# Altium schematic sheet Power.SchDoc
size 420 x 297 mm; SheetNumber: 1; SheetTotal: 2
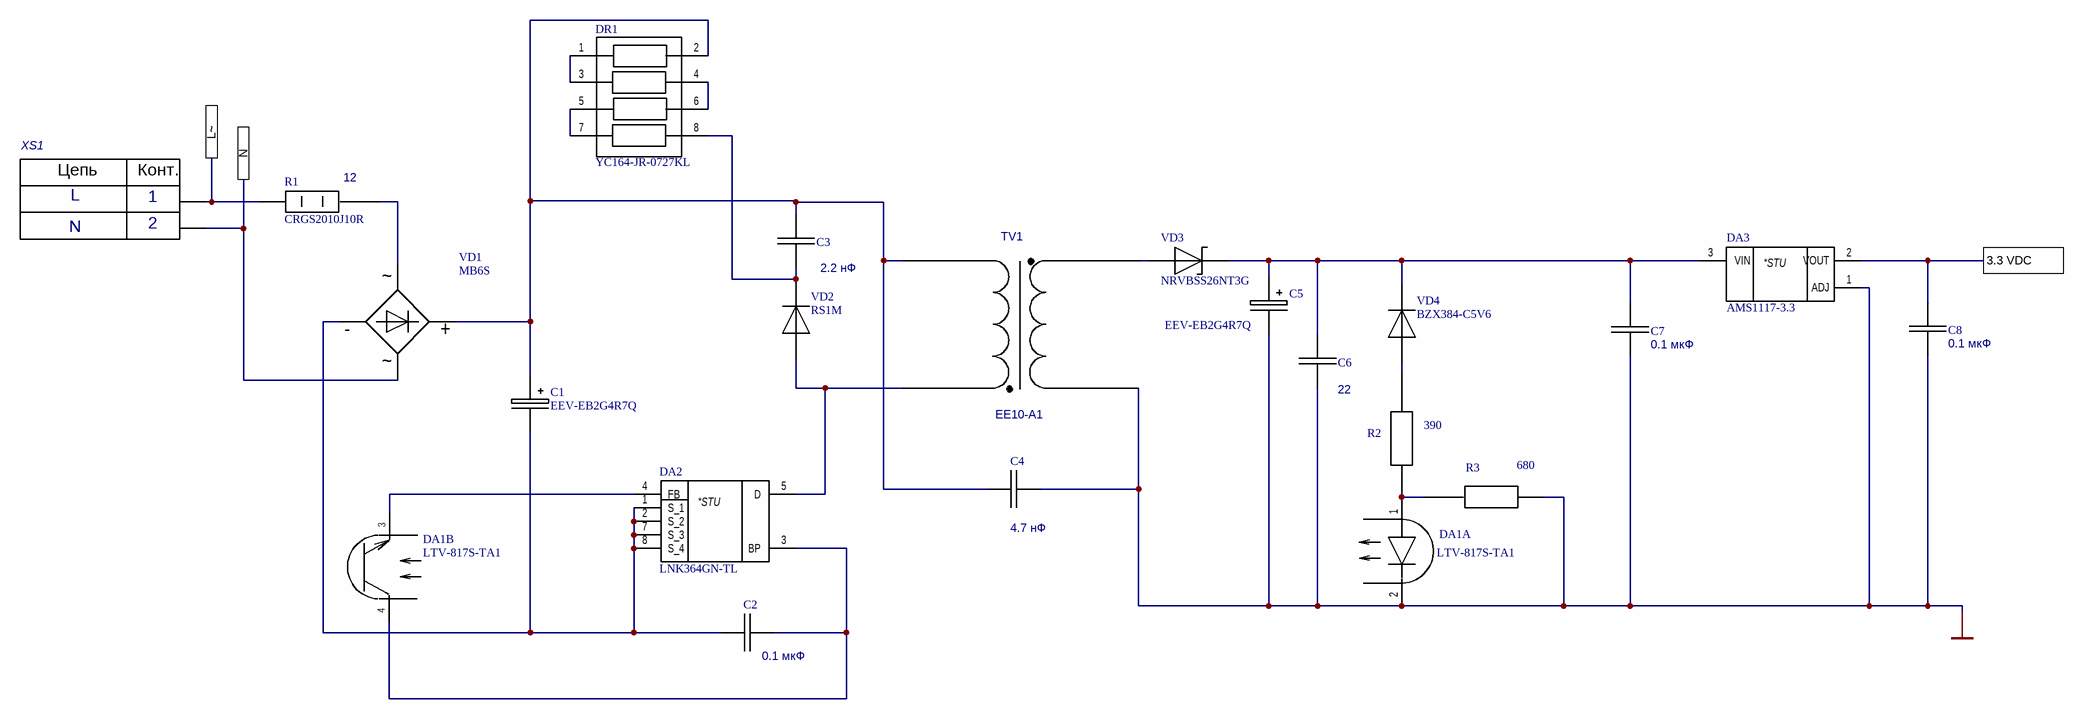
[diagram p0: Power.SchDoc]

## Parts
C1  EEV-EB2G4R7Q  [CAPAE1030X1700N]
C2  value 0.1 мкФ  [С0603]  (hidden comment: 06035C104JAT2A)
C3  value 2.2 нФ  [C1206]  (hidden comment: CC1206KKX7RBBB222)
C4  value 4.7 нФ  [B81123C1472M000]  (hidden comment: Конденсатор неполярный)
C5  EEV-EB2G4R7Q  [CAPAE1030X1700N]
C6  value 22  [C1206]  (hidden comment: CC1206KKX5R7BB226)
C7  value 0.1 мкФ  [С0603]  (hidden comment: 06035C104JAT2A)
C8  value 0.1 мкФ  [С0603]  (hidden comment: 06035C104JAT2A)
DA1  LTV-817S-TA1  [SOP254P1016X400-4N]  (parts A,B of 2)
DA2  LNK364GN-TL  [LNK364GNTL]
DA3  AMS1117-3.3  [SOT229P700X180-4N]
DR1  YC164-JR-0727KL  [CAT161000F4]
R1  CRGS2010J10R  value 12  [RESC5025X65N]
R2  value 390  [R0402]  (hidden comment: RC0402FR-07390RL)
R3  value 680  [R0402]  (hidden comment: RC0402FR-07680RL)
TV1  EE10-A1  [EE10-A1]
VD1  MB6S  [SOP250P700X190-4N]
VD2  RS1M  [DIOM5026X262N]
VD3  NRVBSS26NT3G  [DIOM5436X247N]
VD4  BZX384-C5V6  [SOD2512X110N]
XS1  S2B-PH-K-S  [ED350V-02P]  (value not drawn)

## Ports
3.3 VDC, L~, N

## Nets
DGND: C4.2 C5.2(-) C6.2 C7.1 C8.2 DA1.2(CATHODE) DA3.1(ADJ) R3.1 TV1.5
3.3 VDC: C8.1 DA3.2(VOUT) ; port 3.3 VDC
L~: R1.1 XS1.1 ; port L~
N: VD1.4 XS1.2 ; port N
NetC1_1: C1.1(+) C3.1 C4.1 DR1.2 TV1.1(Vin) VD1.1(+)
NetC1_2: C1.2(-) C2.1 DA2.1(S_1) DA2.2(S_2) DA2.7(S_3) DA2.8(S_4) VD1.2(-)
NetC2_2: C2.2 DA1.4(C) DA2.3(BP)
NetC3_2: C3.2 DR1.8 VD2.1(K)
NetC5_1: C5.1(+) C6.1 C7.2 DA3.3(VIN) VD3.1(K) VD4.1(K)
NetDA1_1: DA1.1(ANODE) R2.1 R3.2
NetDA1_3: DA1.3(E) DA2.4(FB)
NetDA2_5: DA2.5(D) TV1.4 VD2.2(A)
NetDR1_1: DR1.1 DR1.3
NetDR1_4: DR1.4 DR1.6
NetDR1_5: DR1.5 DR1.7
NetR1_2: R1.2 VD1.3
NetR2_2: R2.2 VD4.2(A)
NetTV1_8: TV1.8(Vout) VD3.2(A)

## Notes on the sheet
- N
- L
- Перв. примен.
- Справ. №
- Подп. и дата
- Инв. № дубл.
- Взам. инв. №
- Разраб.
- Изм.
- Лист
- № докум.
- Подп.
- Дата
- Лит.
- Масса
- Масштаб
- Пров.
- Т. контр.
- Листов
- Инв. № подл.
- Н. контр.
- Утв.
- Копировал
- Формат А3
- (in symbol AMS1117-3.3) *STU
- (in symbol LNK364GN-TL) *STU
- (in symbol Разъем_1) Цепь; Конт.

## Library data of the parts
C1 = EEV-EB2G4R7Q: Capacitor Polarised; Manufacturer_Name: Panasonic; Datasheet Link: http://industrial.panasonic.com/cdbs/www-data/pdf/RDE0000/ABA0000C1202.pdf; Height: 17mm; Manufacturer_Part_Number: EEV-EB2G4R7Q; Mouser Part Number: 667-EEV-EB2G4R7Q; Mouser Price/Stock: https://www.mouser.co.uk/ProductDetail/Panasonic/EEV-EB2G4R7Q?qs=h4ONpho3ypMX7%2FLtZhu%252BqQ%3D%3D; Arrow Part Number: EEV-EB2G4R7Q; Arrow Price/Stock: https://www.arrow.com/en/products/eeveb2g4r7q/panasonic?region=nac
C2 C7 C8 = Конденсатор неполярный: Керамический ЧИП-конденсатор 0603 X7R 0.1мкФ ±5% 50В; Manufacturer_Name: KEMET; Manufacturer_Part_Number: CC0402KRX7R7BB222; Datasheet Link: https://componentsearchengine.com/Datasheets/34/CC0402KRX7R7BB222.pdf; Height: 0.55mm
C3 = Конденсатор неполярный: Керамический ЧИП-конденсатор 1206 X7R 2200пФ ±10% 500В; Manufacturer_Name: KEMET; Manufacturer_Part_Number: CC0402KRX7R7BB222; Datasheet Link: https://componentsearchengine.com/Datasheets/34/CC0402KRX7R7BB222.pdf; Height: 0.55mm
C4 = Конденсатор неполярный: Capacitor; Manufacturer_Name: KEMET; Manufacturer_Part_Number: CC0402KRX7R7BB222; Datasheet Link: https://componentsearchengine.com/Datasheets/34/CC0402KRX7R7BB222.pdf; Height: 0.55mm
C5 = Конденсатор полярный: Capacitor Polarised; Manufacturer_Name: Panasonic; Datasheet Link: http://industrial.panasonic.com/cdbs/www-data/pdf/RDE0000/ABA0000C1202.pdf; Height: 17mm; Manufacturer_Part_Number: EEV-EB2G4R7Q; Mouser Part Number: 667-EEV-EB2G4R7Q; Mouser Price/Stock: https://www.mouser.co.uk/ProductDetail/Panasonic/EEV-EB2G4R7Q?qs=h4ONpho3ypMX7%2FLtZhu%252BqQ%3D%3D; Arrow Part Number: EEV-EB2G4R7Q; Arrow Price/Stock: https://www.arrow.com/en/products/eeveb2g4r7q/panasonic?region=nac
C6 = Конденсатор неполярный: Керамический ЧИП-конденсатор 1206 X5R 22мкФ ±10% 16В; Manufacturer_Name: KEMET; Manufacturer_Part_Number: CC0402KRX7R7BB222; Datasheet Link: https://componentsearchengine.com/Datasheets/34/CC0402KRX7R7BB222.pdf; Height: 0.55mm
DA1 = LTV-817S-TA1: Integrated Circuit; Manufacturer_Name: Lite-On; Datasheet Link: http://optoelectronics.liteon.com/upload/download/DS-70-96-0016/LTV-8X7%20series%20201610%20.pdf; Height: 4mm; Manufacturer_Part_Number: LTV-817S-TA1; Mouser Part Number: 859-LTV-817S-TA1; Mouser Price/Stock: https://www.mouser.co.uk/ProductDetail/Lite-On/LTV-817S-TA1?qs=gnaPJ2cis705dA%252BrXNgReQ%3D%3D; Arrow Part Number: LTV-817S-TA1; Arrow Price/Stock: https://www.arrow.com/en/products/ltv-817s-ta1/lite-on-technology?utm_currency=USD&region=nac
DA2 = LNK364GN-TL: AC-DC контроллер; Manufacturer_Name: Power Integrations; Datasheet Link: https://www.power.com/sites/default/files/product-docs/lnk362-364.pdf; Height: 3.68mm; Manufacturer_Part_Number: LNK364GN-TL; Mouser Part Number: 869-LNK364GN-TL; Mouser Price/Stock: https://www.mouser.co.uk/ProductDetail/Power-Integrations/LNK364GN-TL?qs=Jph8NoUxIfUMH738%2FE3y8A%3D%3D
DA3 = AMS1117-3.3: Integrated Circuit; Manufacturer_Name: Advanced; Datasheet Link: https://datasheet.datasheetarchive.com/originals/distributors/Datasheets-28/DSA-550594.pdf; Height: 1.8mm; Manufacturer_Part_Number: AMS1117-3.3
DR1 = Резисторная сборка 4: Resistor Network; Manufacturer_Name: Bourns; Manufacturer_Part_Number: CAT16-2702F4LF; Value: 27K; Datasheet Link: https://bourns.com/docs/product-datasheets/catcay.pdf?sfvrsn=eae9f7ea_24; Height: 0.6mm; Mouser Part Number: 652-CAT16-2702F4LF; Mouser Price/Stock: http://www.mouser.com/Search/ProductDetail.aspx?qs=2cU%252bdy8NdRo19krE2bXLqQ%3d%3d; Arrow Part Number: CAT16-2702F4LF; Arrow Price/Stock: https://www.arrow.com/en/products/cat16-2702f4lf/bourns
R1 = CRGS2010J10R: Resistor; Manufacturer_Name: TE Connectivity; Datasheet Link: http://www.te.com/commerce/DocumentDelivery/DDEController?Action=showdoc&DocId=Data+Sheet%7F9-1773463-8%7FB%7Fpdf%7FEnglish%7FENG_DS_9-1773463-8_B.pdf%7F3-2176251-0; Height: 0.65mm; Manufacturer_Part_Number: CRGS2010J10R; Mouser Part Number: 279-CRGS2010J10R; Mouser Price/Stock: https://www.mouser.co.uk/ProductDetail/TE-Connectivity-Holsworthy/CRGS2010J10R?qs=Rv6LVDxB0ZqF0MPdEdt49w%3D%3D; Arrow Part Number: CRGS2010J10R; Arrow Price/Stock: https://www.arrow.com/en/products/crgs2010j10r/te-connectivity?utm_currency=USD&region=nac
R2 = Резистор: Толстопленочный ЧИП-резистор 0402 390Ом ±1% 0.063Вт -55°С...+155°С; Units: Ом
R3 = Резистор: олстопленочный ЧИП-резистор 0402 680Ом ±1% 0.063Вт -55°С...+155°С; Units: Ом
TV1 = EE10-A1: Импульсный трансформатор 220V; 5-12V; P=1-3W; 100-200kHz
VD1 = MB6S: Bridge Rectifier; Manufacturer_Name: Guangdong Hottech; Height: 1.9mm; Manufacturer_Part_Number: MB6S
VD2 = RS1M: Diode; Manufacturer_Name: Multicomp Pro; Datasheet Link: http://www.farnell.com/datasheets/2863960.pdf; Height: 2.62mm; Manufacturer_Part_Number: RS1M
VD3 = NRVBSS26NT3G: Schottky Diode; Manufacturer_Name: onsemi; Datasheet Link: https://www.onsemi.com/pub/Collateral/SS26-D.PDF; Height: 2.47mm; Manufacturer_Part_Number: NRVBSS26NT3G; Mouser Part Number: 863-NRVBSS26NT3G; Mouser Price/Stock: https://www.mouser.co.uk/ProductDetail/ON-Semiconductor/NRVBSS26NT3G/?qs=xZ%2FP%252Ba9zWqaNJTeScEpd%252Bw%3D%3D
VD4 = BZX384-C5V6: Diode; Manufacturer_Name: Nexperia; Datasheet Link: https://datasheet.datasheetarchive.com/originals/distributors/Datasheets-20/DSA-380039.pdf; Height: 1.1mm; Manufacturer_Part_Number: BZX384-C5V6; Mouser Part Number: N/A; Mouser Price/Stock: https://www.mouser.com/Search/Refine.aspx?Keyword=N%2FA
XS1 = Разъем_1: Гнездо провод-плата;; Value: *